# EAGLE schematic tris (EAGLE 6.5.0)
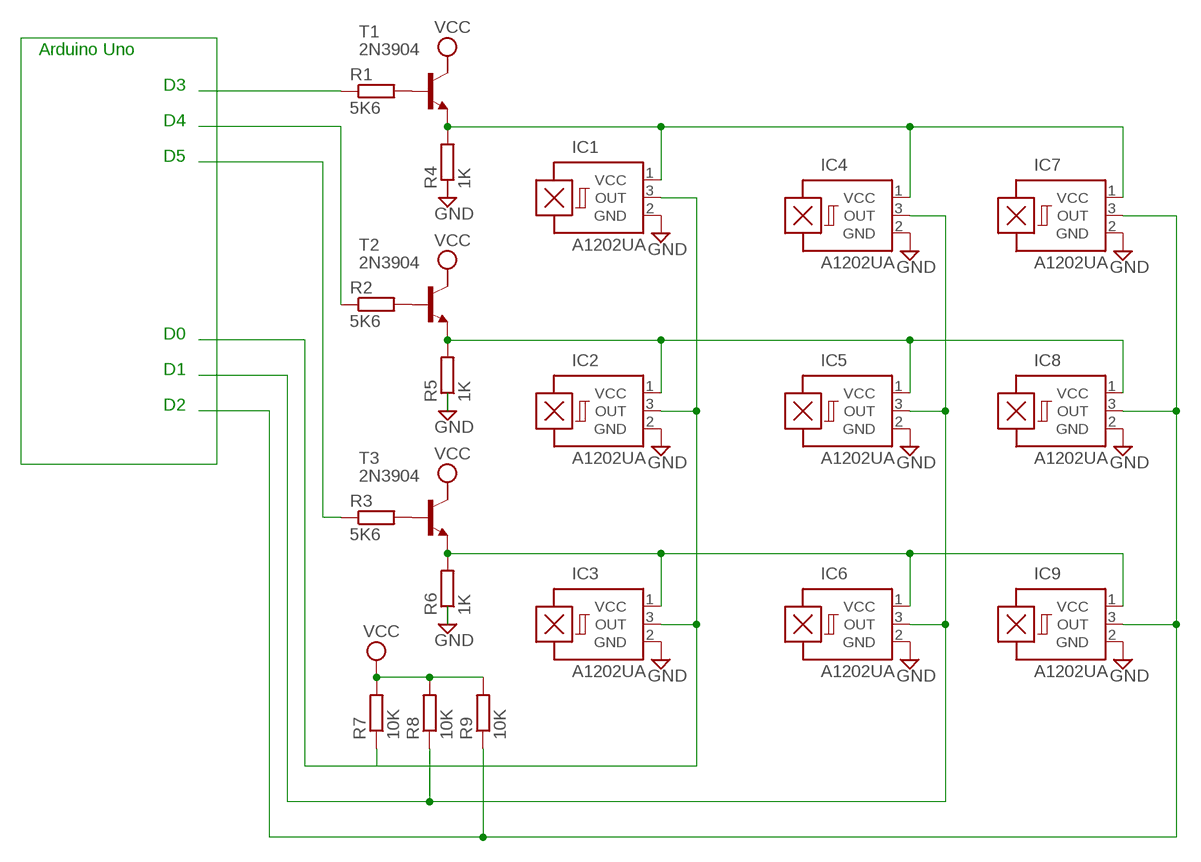
[diagram p0: schematic, sheet 1]

## Parts
IC1  A1202UA  [SIP3-UA]
IC2  A1202UA  [SIP3-UA]
IC3  A1202UA  [SIP3-UA]
IC4  A1202UA  [SIP3-UA]
IC5  A1202UA  [SIP3-UA]
IC6  A1202UA  [SIP3-UA]
IC7  A1202UA  [SIP3-UA]
IC8  A1202UA  [SIP3-UA]
IC9  A1202UA  [SIP3-UA]
R1  5K6  R-EU_0204/7  [0204/7]
R2  5K6  R-EU_0204/7  [0204/7]
R3  5K6  R-EU_0204/7  [0204/7]
R4  1K  R-EU_0204/7  [0204/7]
R5  1K  R-EU_0204/7  [0204/7]
R6  1K  R-EU_0204/7  [0204/7]
R7  10K  R-EU_0204/7  [0204/7]
R8  10K  R-EU_0204/7  [0204/7]
R9  10K  R-EU_0204/7  [0204/7]
T1  2N3904  [TO92]
T2  2N3904  [TO92]
T3  2N3904  [TO92]

## Nets
GND: IC1.2(GND) IC2.2(GND) IC3.2(GND) IC4.2(GND) IC5.2(GND) IC6.2(GND) IC7.2(GND) IC8.2(GND) IC9.2(GND) R5.1 R6.1
N$1: IC1.1(VCC) IC4.1(VCC) IC7.1(VCC) R4.2 T1.3(E)
N$2: IC2.1(VCC) IC5.1(VCC) IC8.1(VCC) R5.2 T2.3(E)
N$3: IC3.1(VCC) IC6.1(VCC) IC9.1(VCC) R6.2 T3.3(E)
N$4: R1.2 T1.2(B)
N$5: R2.2 T2.2(B)
N$6: R3.2 T3.2(B)
N$7: IC1.3(OUT) IC2.3(OUT) IC3.3(OUT) R7.1
N$8: IC4.3(OUT) IC5.3(OUT) IC6.3(OUT) R8.1
N$9: IC7.3(OUT) IC8.3(OUT) IC9.3(OUT) R9.1
N$11: R1.1
N$12: R2.1
N$13: R3.1
VCC: R7.2 R8.2 R9.2
Unconnected: R4.1 T1.1(C) T2.1(C) T3.1(C)

## Notes on the sheet
- Arduino Uno
- D3
- D4
- D5
- D0
- D1
- D2

## Library data of the parts
IC1-IC9 = allegro:A12*?: Hall-effect bipolar switch Source: http://www.allegromicro.com/en/Products/Part_Numbers/1202/1202.pdf; OC_FARNELL: unknown; OC_NEWARK: unknown
R1-R9 = resistor:R-EU_: RESISTOR, European symbol
T1-T3 = transistor:2N3904: NPN TRANSISTOR